# Altium schematic sheet LTE_Adapter_Board_Rev02.SchDoc
size B; SheetNumber: 2; SheetTotal: 6
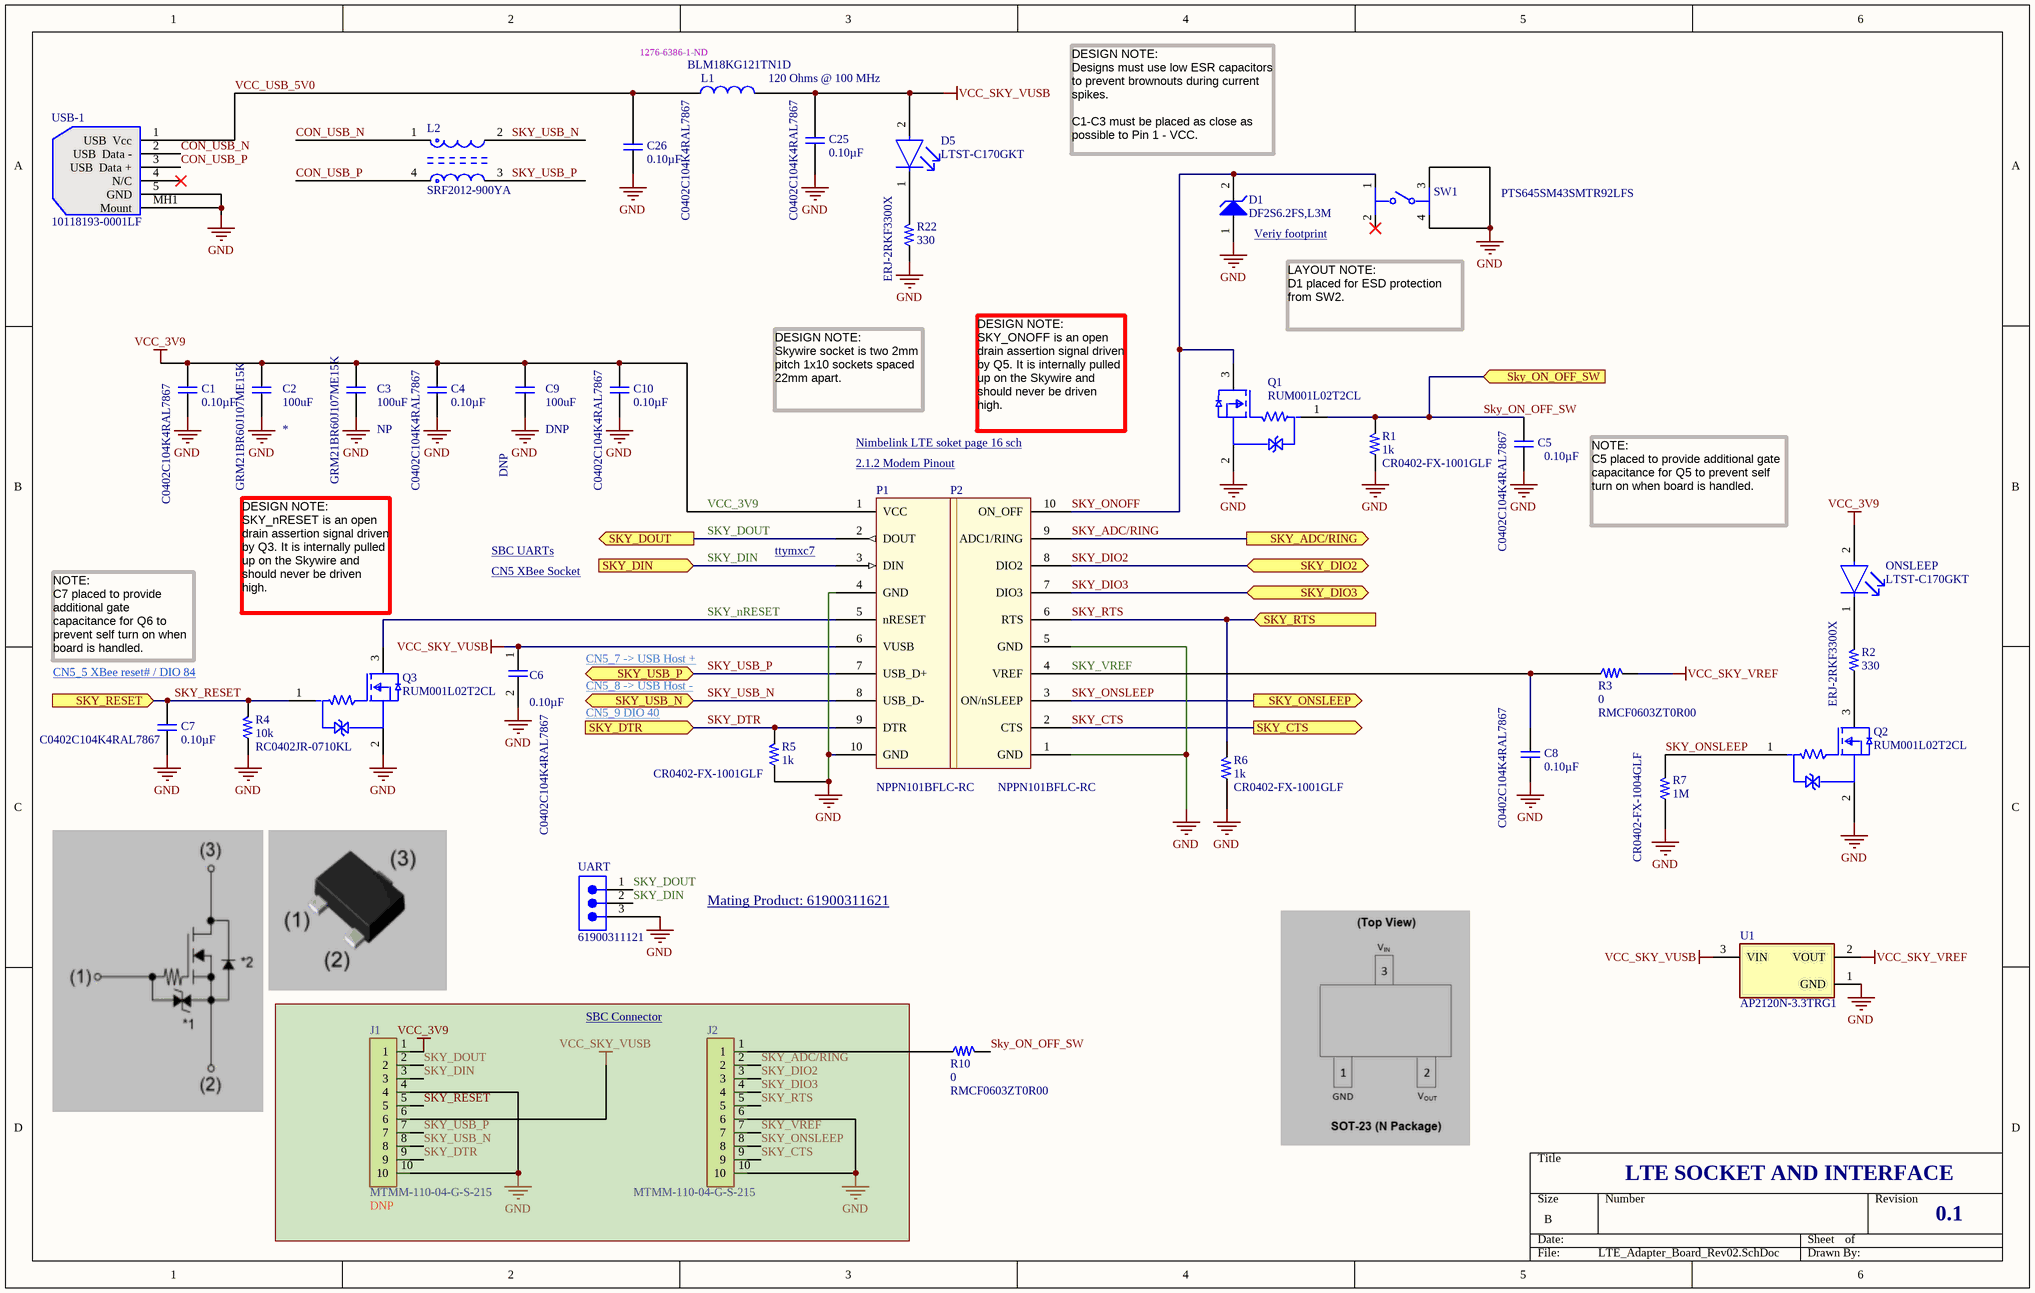
[diagram p0: LTE_Adapter_Board_Rev02.SchDoc]

## Parts
C1  C0402C104K4RAL7867  Capacitance: 0.10µF  [SMD CAP 1005]
C2  GRM21BR60J107ME15K  Capacitance: 100uF  [CAPC1210M]
C3  GRM21BR60J107ME15K  Population: NP  Capacitance: 100uF  [CAPC1210M]
C4  C0402C104K4RAL7867  Capacitance: 0.10µF  [SMD CAP 1005]
C5  C0402C104K4RAL7867  Capacitance: 0.10µF  [SMD CAP 1005]
C6  C0402C104K4RAL7867  Capacitance: 0.10µF  [SMD CAP 1005]
C7  C0402C104K4RAL7867  Capacitance: 0.10µF  [SMD CAP 1005]
C8  C0402C104K4RAL7867  Capacitance: 0.10µF  [SMD CAP 1005]
C9  DNP  Population: DNP  Capacitance: 100uF  [CAPC1210M]
C10  C0402C104K4RAL7867  Capacitance: 0.10µF  [SMD CAP 1005]
C25  C0402C104K4RAL7867  Capacitance: 0.10µF  [SMD CAP 1005]
C26  C0402C104K4RAL7867  Capacitance: 0.10µF  [SMD CAP 1005]
D1  DF2S6.2FS,L3M  [SODFL1006X40N]
D5  LTST-C170GKT  [FP-LTST-C170GKT-MFG]
J1  MTMM-110-04-G-S-215  Assy Note: DNP  [HDRV10W50P200_10X1_2000X200H696]
J2  MTMM-110-04-G-S-215  [HDRV10W50P200_10X1_2000X200H696]
L1  BLM18KG121TN1D  value 120 Ohms @ 100 MHz  Supplier Part Number 1: 1276-6386-1-ND  [INDC1608M]
L2  SRF2012-900YA  [FP-SRF2012A-MFG]
ONSLEEP  LTST-C170GKT  [FP-LTST-C170GKT-MFG]
P1  NPPN101BFLC-RC  [NPPN101BFLC-RC]
P2  NPPN101BFLC-RC  [NPPN101BFLC-RC]
Q1  RUM001L02T2CL  [FP-VMT3-MFG]
Q2  RUM001L02T2CL  [FP-VMT3-MFG]
Q3  RUM001L02T2CL  [FP-VMT3-MFG]
R1  Resistance_Ohms: 1k  [SMD RES 1005]  (hidden comment: CR0402-FX-1001GLF)
R2  ERJ-2RKF3300X  Resistance: 330  [SMD RES 1005]
R3  Resistance: 0  [RESC1608M]  (hidden comment: RMCF0603ZT0R00)
R4  Resistance_Ohms: 10k  [SMD RES 1005]  (hidden comment: RC0402JR-0710KL)
R5  Resistance_Ohms: 1k  [SMD RES 1005]  (hidden comment: CR0402-FX-1001GLF)
R6  Resistance_Ohms: 1k  [SMD RES 1005]  (hidden comment: CR0402-FX-1001GLF)
R7  CR0402-FX-1004GLF  Resistance: 1M  [SMD RES 1005]
R10  Resistance: 0  [RESC1608M]  (hidden comment: RMCF0603ZT0R00)
R22  ERJ-2RKF3300X  Resistance: 330  [SMD RES 1005]
SW1  PTS645SM43SMTR92LFS  [FP-PTS645SM43SMTR92LFS-MFG]
U1  AP2120N-3.3TRG1  [FP-SOT23-MFG]
UART  61900311121  [61900311121]
USB-1  10118193-0001LF  [10118193-0001LF Rev01]

## Blocks framed on the sheet
SBC Connector: J1 J2

## Ports
SKY_ADC/RING (out, see LTE_block_diagram[2B]), SKY_CTS (out, see LTE_block_diagram[2B], LTE_UART_USB_adapter[4B]), SKY_DIN (in, see LTE_block_diagram[2A], LTE_UART_USB_adapter[4B]), SKY_DIO2 (bidir, see LTE_block_diagram[2B]), SKY_DIO3 (bidir, see LTE_block_diagram[2B]), SKY_DOUT (out, see LTE_block_diagram[2A], LTE_UART_USB_adapter[4B]), SKY_DTR (in, see LTE_block_diagram[2B]), Sky_ON_OFF_SW (in, see LTE_block_diagram[2B], LTE_auto_start_Rev01[3B]), SKY_ONSLEEP (out, see LTE_block_diagram[2B]), SKY_RESET (in, see LTE_block_diagram[2A]), SKY_RTS (in, see LTE_block_diagram[2B], LTE_UART_USB_adapter[4B]), SKY_USB_N (bidir, see LTE_block_diagram[2B]), SKY_USB_P (bidir, see LTE_block_diagram[2A])

## Nets
GND: C1.2 C2.2 C3.2 C4.2 C5.2 C6.2 C7.2 C8.2 C9.2 C10.2 C25.2 C26.2 D1.1(A) J1.4 J1.10 J2.6 J2.10 P1.4(GND) P1.10(GND) P2.1(GND) P2.5(GND) Q1.2(Source) Q2.2(Source) Q3.2(Source) R1.1 R4.1 R5.1 R6.1 R7.1 R22.1 SW1.3 SW1.4 U1.1(GND) UART.3 USB-1.5(GND) USB-1.MH1(Mount)
VCC_3V9: C1.1 C2.1 C3.1 C4.1 C9.1 C10.1 J1.1 ONSLEEP.2(A) P1.1(VCC)
VCC_SKY_VREF: R3.2 U1.2(VOUT)
VCC_SKY_VUSB: C6.1 C25.1 D5.2(A) J1.6 L1.1 P1.6(VUSB) U1.3(VIN)
CON_USB_N: L2.1 USB-1.2(USB__Data_-)
CON_USB_P: L2.4 USB-1.3(USB__Data_+)
SKY_ADC/RING: J2.2 P2.9(ADC1/RING) ; port SKY_ADC/RING
SKY_CTS: J2.9 P2.2(CTS) ; port SKY_CTS
SKY_DIN: J1.3 P1.3(DIN) UART.2 ; port SKY_DIN
SKY_DIO2: J2.3 P2.8(DIO2) ; port SKY_DIO2
SKY_DIO3: J2.4 P2.7(DIO3) ; port SKY_DIO3
SKY_DOUT: J1.2 P1.2(DOUT) UART.1 ; port SKY_DOUT
SKY_DTR: J1.9 P1.9(DTR) R5.2 ; port SKY_DTR
SKY_nRESET: P1.5(nRESET) Q3.3(Drain)
Sky_ON_OFF_SW: C5.1 Q1.1(Gate) R1.2 R10.2 ; port Sky_ON_OFF_SW
SKY_ONOFF: D1.2(K) P2.10(ON_OFF) Q1.3(Drain) SW1.1
SKY_ONSLEEP: J2.8 P2.3(ON/nSLEEP) Q2.1(Gate) R7.2 ; port SKY_ONSLEEP
SKY_RESET: C7.1 J1.5 Q3.1(Gate) R4.2 ; port SKY_RESET
SKY_RTS: J2.5 P2.6(RTS) R6.2 ; port SKY_RTS
SKY_USB_N: J1.8 L2.2 P1.8(USB_D-) ; port SKY_USB_N
SKY_USB_P: J1.7 L2.3 P1.7(USB_D+) ; port SKY_USB_P
SKY_VREF: C8.1 J2.7 P2.4(VREF) R3.1
VCC_USB_5V0: C26.1 L1.2 USB-1.1(USB__Vcc)
NetD5_1: D5.1(C) R22.2
NetJ2_1: J2.1 R10.1
NetONSLEEP_1: ONSLEEP.1(C) R2.2
NetQ2_3: Q2.3(Drain) R2.1

Not connected (* = marked no-connect by the designer): SW1 2*; USB-1 4(N/C)*

## Notes on the sheet
- (near D1) DESIGN NOTE:
  Designs must use low ESR capacitors to prevent brownouts during current spikes.
  C1-C3 must be placed as close as possible to Pin 1 - VCC.
- (near D1) Veriy footprint <https://toshiba.semicon-storage.com/info/DF2S6.2FS_datasheet_en_20211216.pdf?did=22218&prodName=DF2S6.2FS>
- LAYOUT NOTE:
  D1 placed for ESD protection from SW2.
- DESIGN NOTE:
  Skywire socket is two 2mm pitch 1x10 sockets spaced 22mm apart.
- DESIGN NOTE:
  SKY_ONOFF is an open drain assertion signal driven by Q5. It is internally pulled up on the Skywire and should never be driven high.
- Nimbelink LTE soket page 16 sch <https://cdn.embeddedts.com/resource-attachments/ts-7553-v2-schematic.pdf>
- (near P1) 2.1.2 Modem Pinout <C:\Users\Roman.Chak\Documents\Projects\UVDI-360\Docs\Datasheets\Cell Modems\NimbeLink\QBG95\Hardware design\1002362_NL-SW-LTE-QBG95_Datasheet.pdf>
- SBC UARTs <https://docs.embeddedts.com/TS-7553-V2#UARTs>
- ttymxc7 <https://docs.embeddedts.com/TS-7553-V2#CN5_XBee_Socket>
- NOTE:
  C5 placed to provide additional gate capacitance for Q5 to prevent self turn on when board is handled.
- DESIGN NOTE:
  SKY_nRESET is an open drain assertion signal driven by Q3. It is internally pulled up on the Skywire and should never be driven high.
- CN5 XBee Socket <https://docs.embeddedts.com/TS-7553-V2#CN5_XBee_Socket>
- 5.2 Power
  Skywire modems will regularly consume high amounts of current on their Power Supplyinput (Pin 1, VCC), up to 1.5A during LTE transmits and receives, and GSMconnections will repeatedly hit 2A during transmissions. These current transients willoften take the modem from consuming ~100mA to >1A in just a few microseconds.
  In order to maintain compatibility with other 4G Skywire modems, the baseboard powersupply should be designed to support peak currents of at least 2 Amps. The powertrace leading from the power supply must be wide enough to ensure a low inductancepath between the power supply, capacitors, and the VCC pin.
  Skywire modems have a recommended input voltage of 3.90V. This recommendedinput voltage is chosen as the optimal input voltage to maximize power efficiency of themodem’s internal power systems. While the modems do support a fairly wide inputvoltage range, it is recommended to power the modems off of 3.90V as any deviationsoutside of the modem’s acceptable operating voltage range may irreparably damage themodem and void the warranty.
  Some modems also support an extended operating voltage range of 3.20V to 4.50V or3.0V to 5.5V. Extreme care must be taken when designing a system that utilizes the low
- (near P2) up to 1.5A during LTE transmits and receives
  the baseboard powersupply should be designed to support peak currents of at least 2 Amps
- (near P2) 19
  QBG96, TM1G,
  SVZM20 RING O R neintwgoInrkditcraaftfoicr.output pin. Used to alert host of incoming
  S7588, S7648,
  S7618RD,TSVG,
  TEUG, TNAG,
  HSPA, WM14,
  GELS3
  ADC1 I ADC input into cellular module. 1.8V, 8-bit or 10-bit resolutiondepending on modem
- (near P2) 20 ALL ON_OFF orPWR_ON I O drNiv_eOnFwFithsigannaolppeinn.dUrsaeindotor otuprennocnoltlheectmorosdiegmna.l
- NOTE:
  C7 placed to provide additional gate capacitance for Q6 to prevent self turn on when board is handled.
- CN5_5 XBee reset# / DIO 84 <https://docs.embeddedts.com/TS-7553-V2#CN5_XBee_Socket>
- UARTs
  7 ttymxc7 XBee/TTL CN5_3 CN5_2
- CN5_7 -> USB Host + <https://docs.embeddedts.com/TS-7553-V2#CN5_XBee_Socket>
- CN5_8 -> USB Host - <https://docs.embeddedts.com/TS-7553-V2#CN5_XBee_Socket>
- 2 (J1-2) DOUT Output
  UART data out, I/O level tied to VREF. Must beimplemented if USB is unused. Otherwise, leaveunconnected if unused.
  0V VREF
- (J1-3) DIN Input
  UART data in, I/O level tied to VREF.
  Must be implemented if USB isunused. Tie to GND with a 1k resistorif unused.
- 4(J1-4)
  GND Input Ground Pin. Must be implemented. 0V
- (near P2) 17
  QBG96 I2C SDA 1.8V I2C Data Signal for I2C output from the cellular module.Requires 4.7Kohm pull-up to 1.8V.
  SVZM20 Reserved This pin is reserved and should be NC
  S7588, S7648,
  S7618RD,
  GELS3, TM1G,
  TSVG, TEUG,
  TNAG, HSPA,
  WM14
  GPIOx I/O Programable 1.8V GPIO
- (near P2) 18
  QBG96 I2C SCL 1.8V I2C Clock Signal for I2C output from the cellular module.Requires 4.7Kohm pull-up to 1.8V.
  SVZM20 Reserved This pin is reserved and should be NC
  S7588, S7648,
  S7618RD,
  GELS3, TM1G,
  TSVG, TEUG,
  TNAG, HSPA,
  WM14
  GPIOx I/O Programable 1.8V GPIO
- CN5_9 DIO 40 <https://docs.embeddedts.com/TS-7553-V2#CN5_XBee_Socket>
- 5(J1-5)
  nRESET Input
  Modem reset signal. Must be driven with an opendrain output and should never be driven high. Leaveunconnected if unused. Internally connected to theON_OFF signal in the Quectel module. Must neverbe tied to GND permanently.
  VIL:
  GNDto0.45V
- 6(J1-6)
  VUSB Input USB connection detection. Leave unconnected if theUSB interface is unused. 3.0V 5.0V 5.25V
- 16 ALL RTS I Ready to send hardware flow control input
- 7(J1-7)
  USB_P I/O
  USB positive differential data signal. Requiresdifferential impedance of 90Ω. Leave unconnected ifthe USB interface is unused.
  Compliant with USB 2.0standard specification.
- 8(J1-8)
  USB_N I/O
  USB differential data bus (-)
  Requires differential impedance of 90Ω. Leaveunconnected if the USB interface is unused.
  Compliant with USB 2.0standard specification.
- 9(J1-9)
  DTR Input
  Data terminal ready signal (sleep mode control), tiedto internal reference voltage of 1.8V. Should be tiedto GND with 1k pull down resistor.
  VIL:
  GNDto0.54V
  VIH:
  1.26Vto5.5V
- (near R6) 12(J2-2)
  CTS Output Clear To Send hardware flow control signal. Leaveunconnected if unused. 0V VREF
- (near R6) 13(J2-3)
  STATUS Output
  Indicates the current operation status of the BG95-M3 module. Driven high when the module is on.Leave unconnected if unused.
  VOL:
  0V to0.45V
  VOH:
  1.35Vto1.8V
- (near R6) 5.5 VREF
  VREF is used as the reference signal for voltage level translators on the Skywire. Thevoltage on VREF should match the host processor’s I/O voltage. VREF will draw lessthan 1mA when the modem is powered.
  System designers should include a method of removing the voltage from VREF whenthe system is in Power Save Mode (PSM) or when the modem is powered down. Onesuch method would be to power VREF from a GPIO or to have a P-CH MOSFET in theVREF signal path
- Mating Product: 61900311621 <https://www.digikey.com/en/products/detail/w%C3%BCrth-elektronik/61900311621/2508637>
- 10(J1-10)
  GND Input Ground Pin. Must be implemented. 0V
- (near R6) 11(J2-1)
  GND Input Ground Pin. Must be implemented. 0V
- LTE SOCKET AND INTERFACE
- 0.1

## Library data of the parts
C1 C4-C8 C10 C25 C26 = 1000742: 0.1 µF ±10% 16V Ceramic Capacitor X7R 0402 (1005 Metric); Manufacturer1: Kemet; Manufacturer_Part_Number1: C0402C104K4RALTU; Item_Phase: Production; Mounting_Type: Surface Mount; Operating_Temperature: -55°C ~ 125°C; Thickness_Max: 0.022" (0.55mm); Value: 0.1uF; Tolerance: ±10%; Applications: General Purpose; Population: *; Part_Number: 1000742; Part_Type: Capacitor; Revision: A; Distributor1: Digi-Key; Distributor_Part_Number1: 399-6342-1-ND; Specs_View: https://app.bom.com/a/YGZ57I1I1KJQDBOE?v=spec.summary; Bom_View: https://app.bom.com/a/YGZ57I1I1KJQDBOE?v=bom.indented; Sourcing_View: https://app.bom.com/a/YGZ57I1I1KJQDBOE?v=sourcing.relationships; Costing_View: https://app.bom.com/a/YGZ57I1I1KJQDBOE?v=costing.summary; Files_View: https://app.bom.com/a/YGZ57I1I1KJQDBOE?v=files.associations; Datasheet_Link: http://www.samsungsem.com/kr/support/product-search/mlcc/CL05B104KO5NNNC.jsp; Capacitor_Type: Ceramic; Package_Case: 0402 (1005 Metric); Size_Dimension: 0.039" L x 0.020" W (1.00mm x 0.50mm); Temperature_Coefficient: X7R; Voltage_Rating: 16V; Distributor2: Digi-Key; Distributor_Part_Number2: 1276-1001-1-ND; Manufacturer2: Samsung Electro-Mechanics America, Inc; Manufacturer_Part_Number2: CL05B104KO5NNNC; Digi-Key Part Number: 399-C0402C104K4RAL7867CT-ND; Manufacturer: KEMET; Manufacturer Product Number: C0402C104K4RAL7867
C2 C3 = 1001241: 100 µF ±20% 6.3V Ceramic Capacitor X5R 0805 (2012 Metric); Manufacturer1: Taiyo Yuden; Manufacturer: Murata Electronics; Tolerance: +/- 20%; Item_Phase: Production; Mounting_Type: Surface Mount; Operating_Temperature: -55C ~ +85C; Thickness_Max: 0.106 (2.70mm)"; Applications: General Purpose; Part_Number: 1001241; Part_Type: Capacitor; Revision: A; Manufacturer_Part_Number1: LMK325BJ107MM-T; Distributor1: Digi-Key; Distributor_Part_Number1: 587-1965-1-ND; Specs_View: https://app.bom.com/a/FXGMOZIZI107USQH?v=spec.summary; Bom_View: https://app.bom.com/a/FXGMOZIZI107USQH?v=bom.indented; Sourcing_View: https://app.bom.com/a/FXGMOZIZI107USQH?v=sourcing.relationships; Costing_View: https://app.bom.com/a/FXGMOZIZI107USQH?v=costing.summary; Files_View: https://app.bom.com/a/FXGMOZIZI107USQH?v=files.associations; Datasheet_Link: http://www.yuden.co.jp/productdata/catalog/en/mlcc_all_e.pdf; Capacitor_Type: Ceramic; Package_Case: 1210 (3225 Metric); Size_Dimension: 0.126 L x 0.098" W (3.20mm x 2.50mm); Temperature_Coefficient: X5R; Voltage_Rating: 6.3V; Digi-Key Part Number: 490-GRM21BR60J107ME15KCT-ND; Manufacturer Product Number: GRM21BR60J107ME15K
  C2: Population: *
C9 = 1001241: 100 µF ±20% 6.3V Ceramic Capacitor X5R 0805 (2012 Metric); Manufacturer1: Taiyo Yuden; Tolerance: +/- 20%; Item_Phase: Production; Mounting_Type: Surface Mount; Operating_Temperature: -55C ~ +85C; Thickness_Max: 0.106 (2.70mm)"; Voltage_Rating: 10V; Applications: General Purpose; Part_Number: 1001241; Part_Type: Capacitor; Revision: A; Manufacturer_Part_Number1: LMK325BJ107MM-T; Distributor1: Digi-Key; Distributor_Part_Number1: 587-1965-1-ND; Specs_View: https://app.bom.com/a/FXGMOZIZI107USQH?v=spec.summary; Bom_View: https://app.bom.com/a/FXGMOZIZI107USQH?v=bom.indented; Sourcing_View: https://app.bom.com/a/FXGMOZIZI107USQH?v=sourcing.relationships; Costing_View: https://app.bom.com/a/FXGMOZIZI107USQH?v=costing.summary; Files_View: https://app.bom.com/a/FXGMOZIZI107USQH?v=files.associations; Datasheet_Link: http://www.yuden.co.jp/productdata/catalog/en/mlcc_all_e.pdf; Capacitor_Type: Ceramic; Package_Case: 1210 (3225 Metric); Size_Dimension: 0.126 L x 0.098" W (3.20mm x 2.50mm); Temperature_Coefficient: X5R; Digi-Key Part Number: DNP; Manufacturer: DNP; Manufacturer Product Number: DNP
D1 = D Zener: Clamp Ipp Tvs Diode Surface Mount SOD-923; Manufacturer: Toshiba Semiconductor and Storage; Published: 8-Jun-2000; LatestRevisionDate: 17-Jul-2002; LatestRevisionNote: Re-released for DXP Platform.; PackageReference: SOD-923; Publisher: Altium Limited; PackageDescription: Diode, Thru-Hole; 2 Leads; 0.7 in Pin Spacing; Digi-Key Part Number: DF2S6.2FSL3MCT-ND; Manufacturer Product Number: DF2S6.2FS,L3M; Value: TVS
D5 ONSLEEP = CMP-1674-00002-6: Green 569nm LED Indication - Discrete 2.1V 0805 (2012 Metric); Manufacturer: Lite-On Inc.; Lens Style: Diffused; Number of Elements: 1; Wavelength: 565nm; Luminous Intensity: 6mcd; Test Current: 10mA; Power Dissipation: 100mW; Reverse Voltage: 5V; Forward Current: 30mA; Lens Transparency: Clear; Viewing Angle: 130°; Lens Color: Colorless; Min Operating Temperature: -55°C; Dominant Wavelength: 569nm; Number of Pins: 2; Max Operating Temperature: 85°C; Forward Voltage: 2.1V; Color: Green; Radiation Hardening: No; Illumination Color: Green; Case Code (Metric): 2012; Case/Package: 0805; Width: 1.25mm; Case Code (Imperial): 0805; Package Quantity: 1; Height: 1.1mm; Depth: 1.25mm; Length: 2mm; Power Rating: 100mW; Lead Free: Lead Free; Number of LEDs: 1; Packaging: Tape and Reel; Mount: Surface Mount; Voltage: 5V; Digi-Key Part Number: 160-1179-1-ND; Manufacturer Product Number: LTST-C170GKT; Value: LED
J1 = MTMM-110-04-G-S-215: Connector Header Through Hole 10 position 0.079" (2.00mm); Manufacturer: Samtec Inc.; Value: Connector Board to Board LTE; Price: None; MP: MTMM-110-04-G-S-215; Availability: Unavailable; Package: None; Digi-Key Part Number: 612-MTMM-110-04-G-S-215-ND; Manufacturer Product Number: MTMM-110-04-G-S-215
J2 = MTMM-110-04-G-S-215: Connector Header Through Hole 10 position 0.079" (2.00mm); Manufacturer: Samtec Inc.; Value: Connector Board to Board LTE; Assy Note: DNP; Price: None; MP: MTMM-110-04-G-S-215; Availability: Unavailable; Package: None; Digi-Key Part Number: 612-MTMM-110-04-G-S-215-ND; Manufacturer Product Number: MTMM-110-04-G-S-215
L1 = Inductor: 120 Ohms @ 100 MHz 1 Power Line Ferrite Bead 0603 (1608 Metric) 3A 30mOhm; Manufacturer: Murata Electronics; Code_IEC: 1005; Published: 8-Jun-2000; LatestRevisionDate: 29-May-2009; LatestRevisionNote: IPC-7351 Footprint Added.; PackageReference: 0402-A; Publisher: Altium Limited; PackageDescription: Chip Inductor; Code_JEITA: 0402; Digi-Key Part Number: 490-5254-1-ND; Manufacturer Product Number: BLM18KG121TN1D; Cost: 0.02594; Supplier 1: Digi-Key
L2 = CMP-07251-000007-1: 2 Line Common Mode Choke Surface Mount 90 Ohms @ 100 MHz 400mA DCR 300mOhm; Manufacturer: Bourns Inc.; Voltage Rating (DC): 50V; Element Configuration: Dual; DC Resistance (DCR): 300mR; Tolerance: 25%; Test Frequency: 100MHz; Resistance: 90R; Core Material: Ferrite; Shielding: Unshielded; Material: Steel; Number of Lines: 2; Insulation Resistance: 10MR; REACH SVHC: No SVHC; Case/Package: 0805; Package Quantity: 1; Height: 1.2mm; Packaging: Tape and Reel; Current Rating: 400mA; Series: SRF2012A; Depth: 1.4mm; Current: 400mA; Mount: Surface Mount; Width: 1.2mm; Max DC Current: 400mA; Halogen Free: Halogen Free; DC Current: 400mA; Length: 2mm; Max Operating Temperature: 125°C; RoHS Compliant: Yes; Impedance: 90R; Min Operating Temperature: -40°C; Termination: SMD/SMT; Digi-Key Part Number: SRF2012-900YACT-ND; Manufacturer Product Number: SRF2012-900YA; ComponentLink1Description: Datasheet; ComponentLink1URL: C:\Users\Roman.Chak\Documents\Projects\UVDI-360\Docs\Datasheets\Inductor\SRF2012A.pdf
P1 = Skywire_Header_1_10: CONN HDR 10POS 0.079 GOLD SMD; Manufacturer: Sullins Connector Solutions; Value: Connector LTE; Digi-Key Part Number: S5901-10-ND; ComponentLink1Description: Digi-Key; ComponentLink1URL: https://www.digikey.com/en/products/detail/sullins-connector-solutions/NPPN101BFLC-RC/810012?s=N4IgTCBcDaIMoFYCcAGAjAWjSjA5AIiALoC%2BQA; ComponentLink2Description: Datasheet; ComponentLink2URL: C:\Users\Roman.Chak\Documents\Projects\UVDI-360\Docs\Datasheets\Header\10489_NPPN101BFLC-RC.pdf; Manufacturer Product Number: NPPN101BFLC-RC
P2 = skywire_header_11_20: CONN HDR 10POS 0.079 GOLD SMD; Manufacturer: Sullins Connector Solutions; Value: Connector LTE; ComponentLink1Description: Datasheet; ComponentLink1URL: C:\Users\Roman.Chak\Documents\Projects\UVDI-360\Docs\Datasheets\Header\10489_NPPN101BFLC-RC.pdf; Manufacturer Product Number: NPPN101BFLC-RC; Digi-Key Part Number: S5901-10-ND
Q1-Q3 = RUM001L02T2CL: N-Channel 20 V 100mA (Ta) 150mW (Ta) Surface Mount VMT3; Manufacturer: Rohm Semiconductor; ComponentLink1Description: Datasheet; ComponentLink1URL: C:\Users\Roman.Chak\Documents\Projects\UVDI-360\Docs\Datasheets\MOSFET\rum001l02t2cl-e.pdf; Digi-Key Part Number: RUM001L02T2CLCT-ND; Manufacturer Product Number: RUM001L02T2CL
R1 R5 R6 = 1000794: 1 kOhms ±1% 0.063W, 1/16W Chip Resistor 0402 (1005 Metric) Thick Film; Manufacturer1: Bourns Inc; Item_Phase: Production; Mounting_Type: Surface Mount; Number_of_Terminations: 2; Operating_Temperature: -55°C ~ 155°C; Temperature_Coefficient: ±100ppm/°C; Part_Number: CR0402-FX-1001GLF; Part_Type: Resistor; Revision: A; Manufacturer_Part_Number1: CR0402-FX-1001GLF; Distributor1: Digi-Key; Distributor_Part_Number1: CR0402-FX-1001GLFTR-ND; Manufacturer2: Samsung Electro-Mechanics America, Inc; Manufacturer_Part_Number2: RC1005F102CS; Distributor2: Digi-Key; Distributor_Part_Number2: 1276-3430-2-ND; Specs_View: https://app.bom.com/a/O6PVX8R8RA9G31AY?v=spec.summary; Bom_View: https://app.bom.com/a/O6PVX8R8RA9G31AY?v=bom.indented; Sourcing_View: https://app.bom.com/a/O6PVX8R8RA9G31AY?v=sourcing.relationships; Costing_View: https://app.bom.com/a/O6PVX8R8RA9G31AY?v=costing.summary; Files_View: https://app.bom.com/a/O6PVX8R8RA9G31AY?v=files.associations; Composition: Thick Film; Datasheet_Link: http://media.digikey.com/pdf/Data%20Sheets/Samsung%20PDFs/RC_Series_ds.pdf; Features: Moisture Resistant; Height: 0.016" (0.40mm); Power: 0.063W, 1/16W; Resistor_Package: 0402 (1005 Metric); Size_Dimension: 0.039" L x 0.020" W (1.00mm x 0.50mm); Tolerance: ±1%; Digi-Key Part Number: CR0402-FX-1001GLFCT-ND; Manufacturer: CR0402-FX-1001GLF; Manufacturer Product Number: CR0402-FX-1001GLF
R2 R22 = 1001162: 330 Ohms ±1% 0.1W, 1/10W Chip Resistor 0402 (1005 Metric) Automotive AEC-Q200 Thick Film; Manufacturer1: Panasonic Electronic Components; Item_Phase: Production; Mounting_Type: Surface Mount; Number_of_Terminations: 2; Operating_Temperature: -55°C ~ 155°C; Temperature_Coefficient: ±100ppm/°C; Part_Number: 1001162; Part_Type: Resistor; Revision: A; Manufacturer_Part_Number1: ERJ-2RKF3300X; Distributor1: Digi-Key; Distributor_Part_Number1: P330LCT-ND; Specs_View: https://app.bom.com/a/1J28AL4L4NMTGF0H?v=spec.summary; Bom_View: https://app.bom.com/a/1J28AL4L4NMTGF0H?v=bom.indented; Sourcing_View: https://app.bom.com/a/1J28AL4L4NMTGF0H?v=sourcing.relationships; Costing_View: https://app.bom.com/a/1J28AL4L4NMTGF0H?v=costing.summary; Files_View: https://app.bom.com/a/1J28AL4L4NMTGF0H?v=files.associations; Composition: Thick Film; Datasheet_Link: http://industrial.panasonic.com/www-cgi/jvcr13pz.cgi?E+PZ+3+AOA0002+ERJ2RKF3300X+7+WW; Features: Automotive AEC-Q200; Height: 0.016" (0.40mm); Power: 0.1W, 1/10W; Resistor_Package: 0402 (1005 Metric); Size_Dimension: 0.039" L x 0.020" W (1.00mm x 0.50mm); Tolerance: ±1%; Digi-Key Part Number: P330LCT-ND; Manufacturer: Panasonic Electronic Components; Manufacturer Product Number: ERJ-2RKF3300X
R3 R10 = 1001176: 0 Ohms Jumper Chip Resistor 0603 (1608 Metric) Automotive AEC-Q200 Thick Film; Manufacturer1: Stackpole Electronics Inc; Item_Phase: Production; Mounting_Type: Surface Mount; Number_of_Terminations: 2; Operating_Temperature: -55°C ~ 125°C; Power: 0.25W, 1/4W; Resistor_Package: 0805 (2012 Metric); Temperature_Coefficient: ±100ppm/°C; Tolerance: ±1%; Part_Number: RMCF0603ZT0R00; Part_Type: Resistor; Revision: A; Distributor1: Digi-Key; Distributor_Part_Number1: RMCF0603ZT0R00CT-ND; Specs_View: https://app.bom.com/a/Q8RXZATATCBI53HK?v=spec.summary; Bom_View: https://app.bom.com/a/Q8RXZATATCBI53HK?v=bom.indented; Sourcing_View: https://app.bom.com/a/Q8RXZATATCBI53HK?v=sourcing.relationships; Costing_View: https://app.bom.com/a/Q8RXZATATCBI53HK?v=costing.summary; Files_View: https://app.bom.com/a/Q8RXZATATCBI53HK?v=files.associations; Composition: Thick Film; Datasheet_Link: http://industrial.panasonic.com/lecs/www-data/pdf/AOA0000/AOA0000CE3.pdf; Features: Automotive AEC-Q200, Current Sense; Height: 0.028" (0.70mm); Size_Dimension: 0.079" L x 0.049" W (2.00mm x 1.25mm); Digi-Key Part Number: RMCF0603ZT0R00CT-ND; Manufacturer: Stackpole Electronics Inc; Manufacturer Product Number: RMCF0603ZT0R00
R4 = 1000795: 10 kOhms ±5% 0.063W, 1/16W Chip Resistor 0402 (1005 Metric) Moisture Resistant Thick Film; Manufacturer1: Bourns Inc; Manufacturer_Part_Number1: CR0402-FX-1002GLF; Manufacturer: YAGEO; Item_Phase: Production; Mounting_Type: Surface Mount; Number_of_Terminations: 2; Operating_Temperature: -55°C ~ 155°C; Temperature_Coefficient: ±100ppm/°C; Tolerance: ±1%; Part_Number: RC0402JR-0710KL; Part_Type: Resistor; Revision: A; Distributor1: Digi-Key; Distributor_Part_Number1: CR0402-FX-1002GLFTR-ND; Manufacturer2: Bourns Inc; Manufacturer_Part_Number2: CR0402-FX-1002GAS; Distributor2: Digi-Key; Distributor_Part_Number2: CR0402-FX-1002GASTR-ND; Specs_View: https://app.bom.com/a/P7QWY9S9SBAH42BP?v=spec.summary; Bom_View: https://app.bom.com/a/P7QWY9S9SBAH42BP?v=bom.indented; Sourcing_View: https://app.bom.com/a/P7QWY9S9SBAH42BP?v=sourcing.relationships; Costing_View: https://app.bom.com/a/P7QWY9S9SBAH42BP?v=costing.summary; Files_View: https://app.bom.com/a/P7QWY9S9SBAH42BP?v=files.associations; Composition: Thick Film; Datasheet_Link: http://media.digikey.com/pdf/Data%20Sheets/Samsung%20PDFs/RC_Series_ds.pdf; Features: Moisture Resistant; Height: 0.016" (0.40mm); Power: 0.063W, 1/16W; Resistor_Package: 0402 (1005 Metric); Size_Dimension: 0.039" L x 0.020" W (1.00mm x 0.50mm); Digi-Key Part Number: 311-10KJRCT-ND; Manufacturer Product Number: RC0402JR-0710KL
R7 = 1000797: 1 MOhms ±1% 0.063W, 1/16W Chip Resistor 0402 (1005 Metric) Thick Film; Manufacturer1: Bourns Inc; Manufacturer: Bourns Inc.; Item_Phase: Production; Mounting_Type: Surface Mount; Number_of_Terminations: 2; Operating_Temperature: -55°C ~ 155°C; Temperature_Coefficient: ±100ppm/°C; Part_Number: 1000797; Part_Type: Resistor; Revision: A; Manufacturer_Part_Number1: CR0402-FX-1004GLF; Distributor1: Digi-Key; Distributor_Part_Number1: CR0402-FX-1004GLFTR-ND; Manufacturer2: Samsung Electro-Mechanics America, Inc; Manufacturer_Part_Number2: RC1005F105CS; Distributor2: Digi-Key; Distributor_Part_Number2: 1276-3433-2-ND; Specs_View: https://app.bom.com/a/R9SY0BUBUDCJ64DV?v=spec.summary; Bom_View: https://app.bom.com/a/R9SY0BUBUDCJ64DV?v=bom.indented; Sourcing_View: https://app.bom.com/a/R9SY0BUBUDCJ64DV?v=sourcing.relationships; Costing_View: https://app.bom.com/a/R9SY0BUBUDCJ64DV?v=costing.summary; Files_View: https://app.bom.com/a/R9SY0BUBUDCJ64DV?v=files.associations; Composition: Thick Film; Datasheet_Link: http://media.digikey.com/pdf/Data%20Sheets/Samsung%20PDFs/RC_Series_ds.pdf; Features: Moisture Resistant; Height: 0.016" (0.40mm); Power: 0.063W, 1/16W; Resistor_Package: 0402 (1005 Metric); Size_Dimension: 0.039" L x 0.020" W (1.00mm x 0.50mm); Tolerance: ±1%; Digi-Key Part Number: CR0402-FX-1004GLFCT-ND; Manufacturer Product Number: CR0402-FX-1004GLF
SW1 = CMP-2000-05160-2: SWITCH TACTILE SPST-NO 0.05A 12V; Manufacturer: C&K; Contact Resistance: 100mR; Throw Configuration: SPST; Illumination Type: Non-Illuminated; Mechanical Life: 100000Cycles; Current Rating: 50mA; Switch Function: Off-Mom; Actuator Length: 0.85mm; Actuator Material: Nylon; Actuator Type: Standard; Operating Force: 160gf; Min Operating Temperature: -20°C; REACH SVHC: No SVHC; Termination: Gull Wing; Case/Package: SMD/SMT; Packaging: Tape and Reel; Mount: Surface Mount; Voltage Rating (DC): 12V; Orientation: Straight; Lead Free: Lead Free; Contact Material: Silver; Color: Black; Max Current Rating: 50mA; Contact Plating: Silver; Depth: 9mm; Package Quantity: 1; Max Voltage Rating (DC): 12V; Length: 6mm; Max Operating Temperature: 60°C; Digi-Key Part Number: CKN9112CT-ND; Manufacturer Product Number: PTS645SM43SMTR92 LFS; Value: Switch
U1 = CMP-12756-000008-1: Linear Voltage Regulator IC Positive Fixed 1 Output 150mA SOT-23-3; Manufacturer: Diodes Incorporated; Output Voltage: 3.3V; Min Supply Voltage: 2V; Standoff Height: 0.013mm; Max Junction Temp: +85°C; Max Supply Voltage: 6V; Accuracy Percentage: 2%; Nominal Supply Current: 25uA; Dropout Voltage: 300mV; Number Of Outputs: 1; Footprint Url: https://www.diodes.com/assets/Package-Files/SOT23.pdf; Category: IC; Manufacturer Part Number: AP2120N-3.3TRG1; ComponentLink2Description: Package; Device Class L1: Integrated Circuits (ICs); Octopart: https://octopart.com/ap2120n-3.3trg1-diodes+inc.-30954573; Temperature Range Low: -40°C; Temperature: -40°C to +85°C; Temperature Range High: +85°C; Package: SOT23; Digikey Description: IC REG LINEAR 3.3V 150MA SOT23; Output Type: Fixed; Height: 1.1mm; Mouser Description: AP2120 Series 3.3 V 0.15 A Surface Mount CMOS LDO Regulator - SOT23; RoHS: TRUE; ComponentLink2URL: https://www.diodes.com/assets/Package-Files/SOT23.pdf; Device Class L2: Power Management ICs; Device Class L3: Voltage Regulators - Linear; Output Current: 150mA; Ipc Land Pattern Name: SOT92P240X102-3; Lead Free: Yes; Automotive: No; Digi-Key Part Number: AP2120N-3.3TRG1DICT-ND; Manufacturer Product Number: AP2120N-3.3TRG1; ComponentLink3Description: Datasheet; ComponentLink3URL: C:\Users\Roman.Chak\Documents\Projects\UVDI-360\Docs\Datasheets\Diodes Incorporated\AP2120.pdf
UART = CMP-1502-00585-2: Connector Header Through Hole 3 position 0.100" (2.54mm); NexarPartId: 18818222; Manufacturer: Würth Elektronik; Current Rating: 3A; Voltage Rating: 250V; Number of Positions: 3; Insulation Resistance: 1GΩ; Gender: Male; Connector Type: Male Pin; Contact Resistance: 20mΩ; Termination: Through Hole; Width: 7.66mm; Contact Plating: Tin; Orientation: Vertical; Mount: Through Hole; Contact Gender: Male; Max Operating Temperature: 105°C; Length: 7.62mm; Number of Rows: 1; Height: 12.5mm; Lead Pitch: 2.54mm; Housing Material: Nylon; Color: Beige; Contact Material: Copper; Fastening Type: Friction; Min Operating Temperature: -40°C; Number of Contacts: 3; Pitch: 2.54mm; Number of Pins: 3; Flammability Rating: UL94 V-0; Contact Mating Length: 7.493mm; RoHS: Compliant; REACH SVHC: Unknown; Packaging: Bulk; Operating Supply Voltage: 250V; DigiKey Part Number: 732-2696-ND; Manufacturer Product Number: 61900311121
USB-1 = USB mini: USB - micro B USB 2.0 Receptacle Connector 5 Position Surface Mount, Right Angle, Horizontal; Manufacturer: FCI; Loc: Vendor; Assembly Note: Install; Value: CONN USB MICRO B RECPT SMT R/A; Alternative: None; Protorype Price: 0.46000; Manufacturer Part Number: 10118193-0001LF; Type: SMD; Supplier 1: Digi-Key; Purchased by: Vendor; Price for 100: 0.30320; Cost: 0.25988; Supplier 2: Digi-Key; Digi-Key Part Number: 609-4616-1-ND; ComponentLink1URL: C:\Users\rchak\Documents\Projects\WiFi Node Rev2.0\Docs\Datasheets\USB\10118193.pdf; ComponentLink1Description: C datasheet; ComponentLink2URL: C:\Users\rchak\Documents\Projects\WiFi Node Rev2.0\Docs\Datasheets\USB; ComponentLink2Description: Folder